# EAGLE design sensor_esp32 (EAGLE 6.2)
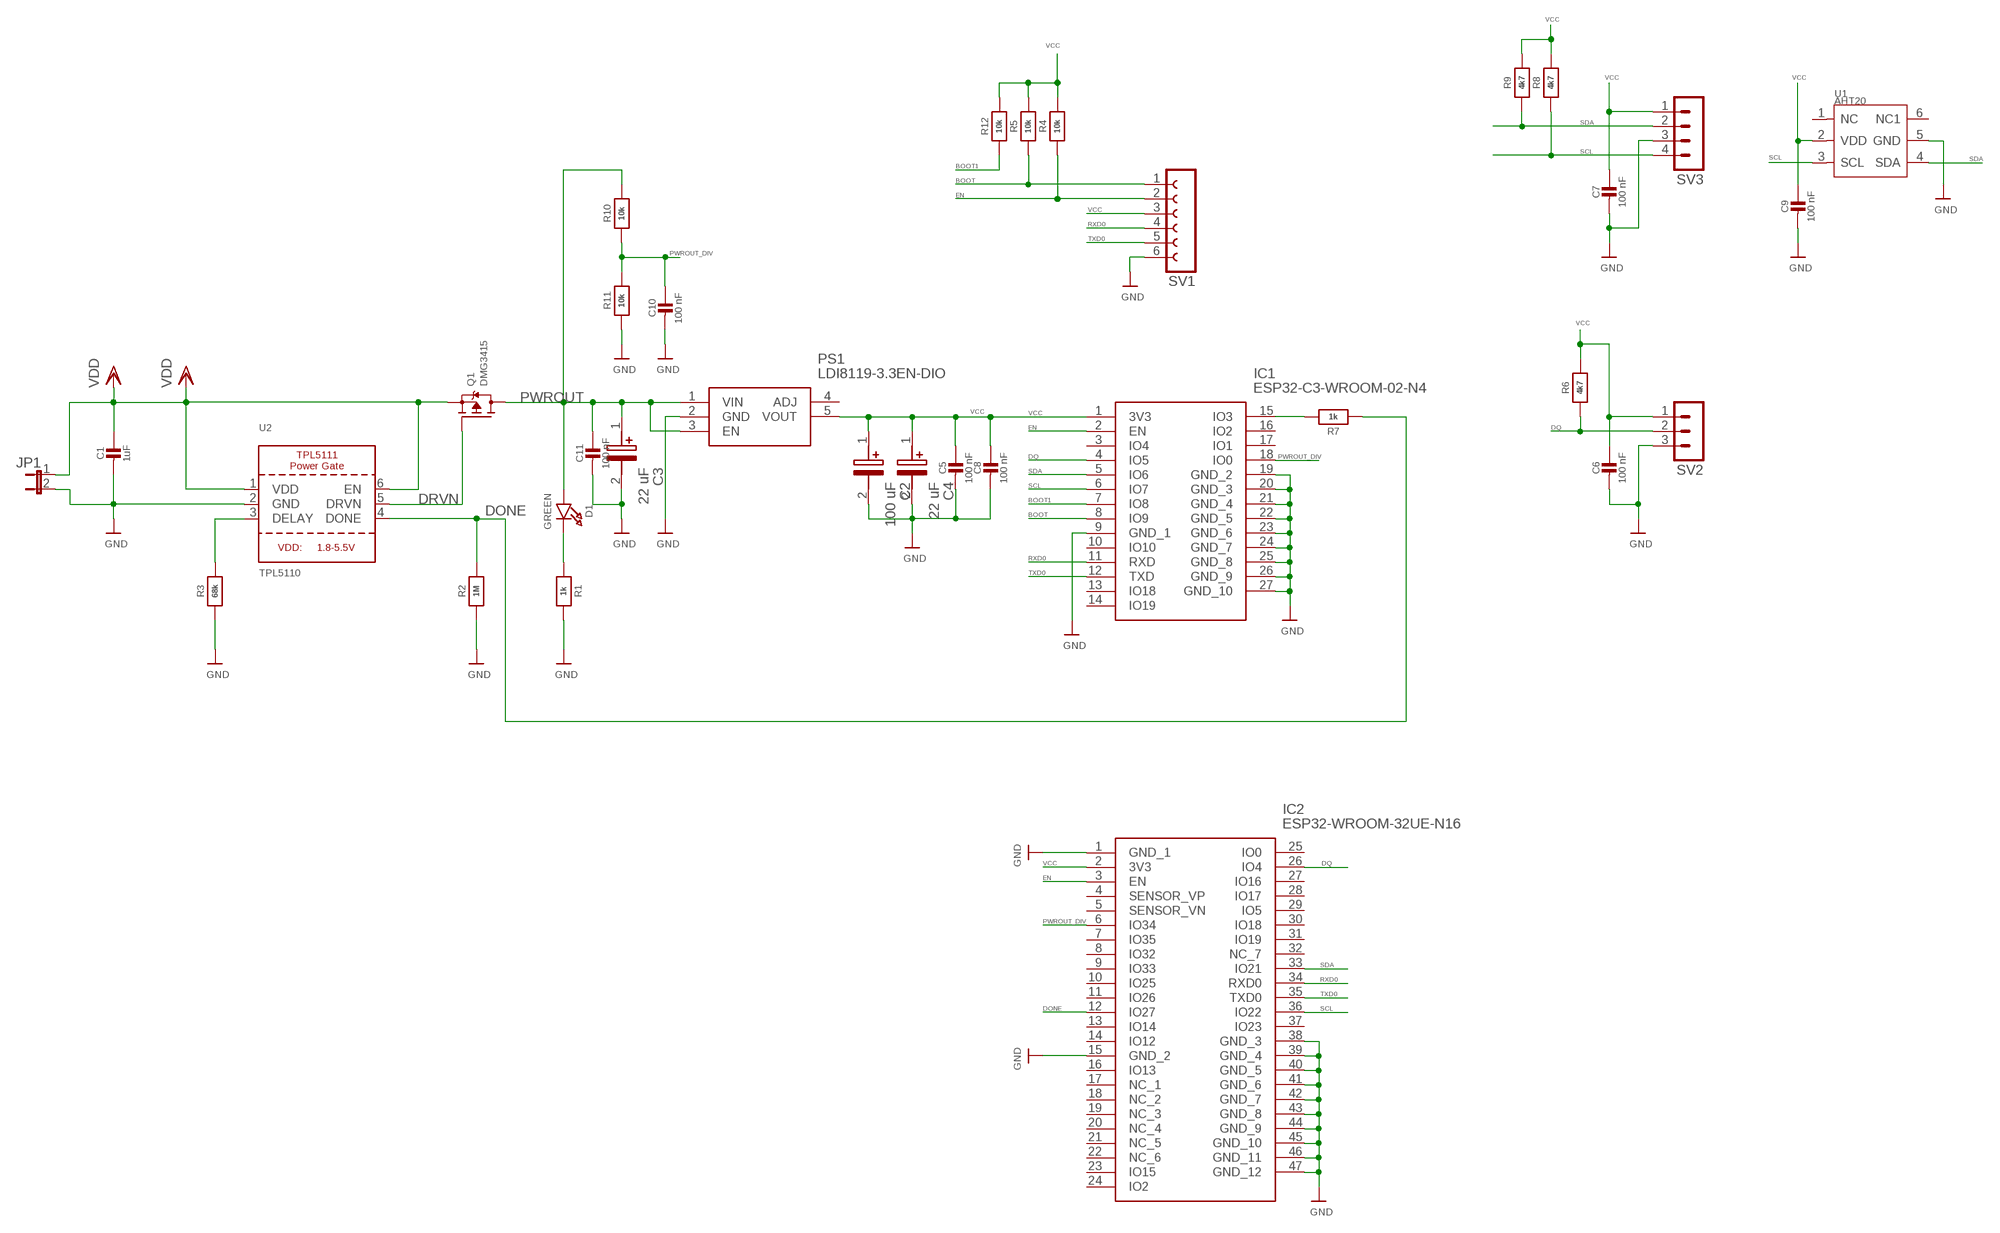
[diagram p0: schematic, sheet 1]

## Parts
C1  1uF  CAP_CERAMIC0805-NOOUTLINE  [0805-NO]
C2  100 uF  293D107X9010C2TE3  [CAPPM6032X280N]
C3  22 uF  293D226X9010A2TE3  [CAPPM3216X180N]
C4  22 uF  293D226X9010A2TE3  [CAPPM3216X180N]
C5  100 nF  CAP_CERAMIC_0603  [_0603]
C6  100 nF  CAP_CERAMIC_0603  [_0603]
C7  100 nF  CAP_CERAMIC_0603  [_0603]
C8  100 nF  CAP_CERAMIC_0603  [_0603]
C9  100 nF  CAP_CERAMIC_0603  [_0603]
C10  100 nF  CAP_CERAMIC_0603  [_0603]
C11  100 nF  CAP_CERAMIC_0603  [_0603]
D1  GREEN  LED0805_NOOUTLINE  [CHIPLED_0805_NOOUTLINE]
IC1  ESP32-C3-WROOM-02-N4  [ESP32C3WROOM02N4]
IC2  ESP32-WROOM-32UE-N16  [ESP32WROOM32UEN16]
JP1  JP1E  [JP1]
PS1  LDI8119-3.3EN-DIO  AP2202K-3.3TRG1  [SOT95P282X145-5N]
Q1  DMG3415  MOSFET-PWIDE  [SOT23-WIDE]
R1  1k  RESISTOR_0603  [_0603]
R2  1M  RESISTOR_0603  [_0603]
R3  68k  RESISTOR_0603  [_0603]
R4  10k  RESISTOR_0603  [_0603]
R5  10k  RESISTOR_0603  [_0603]
R6  4k7  RESISTOR_0603  [_0603]
R7  1k  RESISTOR_0603  [_0603]
R8  4k7  RESISTOR_0603  [_0603]
R9  4k7  RESISTOR_0603  [_0603]
R10  10k  RESISTOR_0603  [_0603]
R11  10k  RESISTOR_0603  [_0603]
R12  10k  RESISTOR_0603  [_0603]
SV1  FE06-1  [FE06]
SV2  MA03-1  [MA03-1]
SV3  MA04-1  [MA04-1]
U1  AHT20  SENSOR-AHT20  [SNR6-1.0-3X3X1MM]
U2  TPL5110  TPL5111  [SOT23-6]

## Nets
BOOT: IC1.8(IO9) R5.1 SV1.1
BOOT1: IC1.7(IO8) R12.1
DELAY: R3.2 U2.3(DELAY)
DONE: IC2.12(IO27) R2.2 R7.1 U2.4(DONE)
DQ: IC1.4(IO5) IC2.26(IO4) R6.1 SV2.2
DRVN: Q1.1(G) U2.5(DRVN)
EN: IC1.2(EN) IC2.3(EN) R4.1 SV1.2
GND: C1.2 C2.2(-) C3.2(-) C4.2(-) C5.2 C6.2 C7.2 C8.2 C9.2 C10.2 C11.2 IC1.9(GND_1) IC1.19(GND_2) IC1.20(GND_3) IC1.21(GND_4) IC1.22(GND_5) IC1.23(GND_6) IC1.24(GND_7) IC1.25(GND_8) IC1.26(GND_9) IC1.27(GND_10) IC2.1(GND_1) IC2.15(GND_2) IC2.38(GND_3) IC2.39(GND_4) IC2.40(GND_5) IC2.41(GND_6) IC2.42(GND_7) IC2.43(GND_8) IC2.44(GND_9) IC2.45(GND_10) IC2.46(GND_11) IC2.47(GND_12) JP1.2 PS1.2(GND) R1.2 R2.1 R3.1 R11.1 SV1.6 SV2.3 SV3.3 U1.5(GND) U2.2(GND)
N$1: IC1.15(IO3) R7.2
N$3: D1.C R1.1
PWROUT: C3.1(+) C11.1 D1.A PS1.1(VIN) PS1.3(EN) Q1.3(D) R10.2
PWROUT_DIV: C10.1 IC1.18(IO0) IC2.6(IO34) R10.1 R11.2
RXD0: IC1.11(RXD) IC2.34(RXD0) SV1.4
SCL: IC1.6(IO7) IC2.36(IO22) R8.1 SV3.4 U1.3(SCL)
SDA: IC1.5(IO6) IC2.33(IO21) R9.1 SV3.2 U1.4(SDA)
TXD0: IC1.12(TXD) IC2.35(TXD0) SV1.5
VCC: C2.1(+) C4.1(+) C5.1 C6.1 C7.1 C8.1 C9.1 IC1.1(3V3) IC2.2(3V3) PS1.5(VOUT) R4.2 R5.2 R6.2 R8.2 R9.2 R12.2 SV1.3 SV2.1 SV3.1 U1.2(VDD)
VDD: C1.1 JP1.1 Q1.2(S) U2.1(VDD) U2.6(EN)
Unconnected: IC1.3(IO4) IC1.10(IO10) IC1.13(IO18) IC1.14(IO19) IC1.16(IO2) IC1.17(IO1) IC2.4(SENSOR_VP) IC2.5(SENSOR_VN) IC2.7(IO35) IC2.8(IO32) IC2.9(IO33) IC2.10(IO25) IC2.11(IO26) IC2.13(IO14) IC2.14(IO12) IC2.16(IO13) IC2.17(NC_1) IC2.18(NC_2) IC2.19(NC_3) IC2.20(NC_4) IC2.21(NC_5) IC2.22(NC_6) IC2.23(IO15) IC2.24(IO2) IC2.25(IO0) IC2.27(IO16) IC2.28(IO17) IC2.29(IO5) IC2.30(IO18) IC2.31(IO19) IC2.32(NC_7) IC2.37(IO23) PS1.4(ADJ) U1.1(NC) U1.6(NC1)

## Library data of the parts
C1 C5-C11 = microbuilder:CAP_CERAMIC: Ceramic Capacitors For new designs, use the packages preceded by an '_' character since they are more reliable: The following footprints should be used on most boards: _0402 - Standard footprint for regular board layouts _0603 - Standard footprint for regular board layouts _0805 - Standard footprint for regular board layouts _1206 - Standard footprint for regular board layouts For extremely tight-pitch boards where space is at a premium, the following 'micro-pitch' footprints can be used (smaller pads, no silkscreen outline, etc.): _0402MP - Micro-pitch footprint for very dense/compact boards _0603MP - Micro-pitch footprint for very dense/compact boards _0805MP - Micro-pitch footprint for very dense/compact boards _1206MP - Micro-pitch footprint for very dense/compact boards
C2 = 293D107X9010C2TE3:293D107X9010C2TE3: Solid Tantalum Surface Mount Chip Capacitors TANTAMOUNT(TM), Molded Case, Standard Industrial Grade Source: Datasheet <http://www.vishay.com/docs/40002/293d.pdf>; DESCRIPTION: Solid Tantalum Surface Mount Chip Capacitors TANTAMOUNT(TM), Molded Case, Standard Industrial Grade; HEIGHT: 2.8mm; MANUFACTURER_NAME: Vishay; MANUFACTURER_PART_NUMBER: 293D107X9010C2TE3
C3 C4 = 293D226X9010A2TE3:293D226X9010A2TE3: Solid Tantalum Surface Mount Chip Capacitors TANTAMOUNT(TM), Molded Case, Standard Industrial Grade Source: Datasheet <http://www.vishay.com/docs/40002/293d.pdf>; DESCRIPTION: Solid Tantalum Surface Mount Chip Capacitors TANTAMOUNT(TM), Molded Case, Standard Industrial Grade; HEIGHT: 1.8mm; MANUFACTURER_NAME: Vishay; MANUFACTURER_PART_NUMBER: 293D226X9010A2TE3
D1 = microbuilder:LED: LED 0603 - 0603 Surface Mount Package 2mA: Green LED - Low Power (3.9mcd, 2ma, 1.7Vf) - Digikey: 475-2709-2-ND Orange LED - Low Power (9.8mcd, 2ma, 1.8Vf) - Digikey: 475-1194-2-ND Red LED - Low Power (5mcd, 2ma, 1.8Vf) - Digikey: 475-1195-2-ND Yellow LED - Low Power (7mcd, 2ma, 1.8Vf) - Digikey: 475-1196-2-ND 5mA: Blue LED - Low Power (17mcd, 5ma, 2.9Vf) - Digikey: LNJ937W8CRACT-ND 0805 - 0805 Surface Mount Package 2mA: Red LED (8.8mcd, 2mA, 1.8Vf, Clear) - Low Power [Digikey: 475-2510-1-ND] Green LED (5mcd, 2mA, 1.8Vf, Clear) - Low Power [Digikey: 475-2730-1-ND] Yellow LED (11.3mcd, 2mA, 1.8Vf, Clear) - Low Power [Digikey: 475-2555-1-ND] 20mA: Red LED (104mcd, 20mA, Diffused) - LS R976 [Digikey: 475-1278-6-ND] Red LED (12mcd, 20mA, 2.0Vf, Clear) - APT2012EC [Digikey: 754-1128-1-ND] Green LED (15mcd, 20mA, 2.2Vf, Clear) - APT2012GC [Digikey: 754-1131-1-ND] Orange LED (160mcd, 20mA, 2.1Vf, Clear) - APT2012SECK [Digikey: 754-1130-1-ND] 1206 - 1206 Surface Mount Package Green LED (26mcd, 20mA, Diffused) - LG N971 [Digikey: 475-1407-6-ND] Red LED (15mcd, 20mA, Diffused) - LH N974 [Digikey: 475-1416-6-ND] Cree - Cree High-Power Surface Mount LEDs XPEBWT-L1-0000-00D50 - White 111lm 350mA 2.9Vf 6200K 110° XTEAWT-00-0000-00000LEE3 - White 114lm 350mA 2.85Vf 5000K 115° Everlight - Everlight 45-21 Series Surface Mount LEDs 45-21/QK2C-B2832AC2CB2/2T - Warm White 2000mcd 20mA 3.25Vf 3050K 120° 45-21/LK2C-B38452C4CB2/2T - Nuetral White 2000mcd 20mA 3.25Vf 4150K 120° 45-21/LK2C-B50634C6CB2/2T - Cold White 2200mcd 20mA 3.25Vf 5650K 120° PLCC2 Reverse Mount LS T77K-J1L2-1-0-2-R18-Z - Red 11.25mcd 2mA 1.8Vf 630nm 120° LO T77K-L1M2-24-Z - Orange 19.6mcd 2mA 1.8Vf 606nm 120° LY T77K-K2M1-26-Z - Yellow 15.7mcd 2mA 1.8Vf 587nm 120°
IC1 = ESP32-C3-WROOM-02-N4:ESP32-C3-WROOM-02-N4: WiFi Modules (802.11) (Engineering Samples) SMD module, ESP32-C3, 4MB SPI flash, PCB antenna, -40 C +85 C Source: Datasheet <https://www.mouser.ch/datasheet/2/891/Espressif_ESP32_C3_WROOM_02-2006871.pdf>; DESCRIPTION: WiFi Modules (802.11) (Engineering Samples) SMD module, ESP32-C3, 4MB SPI flash, PCB antenna, -40 C +85 C; HEIGHT: 3.35mm; MANUFACTURER_NAME: Espressif Systems; MANUFACTURER_PART_NUMBER: ESP32-C3-WROOM-02-N4
IC2 = ESP32-WROOM-32UE-N16:ESP32-WROOM-32UE-N16: Module: IoT; Bluetooth Low Energy,WiFi; SMD; 18x19.2x3.2mm; U.FL Source: Datasheet <https://www.espressif.com/sites/default/files/documentation/esp32-wroom-32e_esp32-wroom-32ue_datasheet_en.pdf>; DESCRIPTION: Module: IoT; Bluetooth Low Energy,WiFi; SMD; 18x19.2x3.2mm; U.FL; HEIGHT: 3.35mm; MANUFACTURER_NAME: Espressif Systems; MANUFACTURER_PART_NUMBER: ESP32-WROOM-32UE-N16
JP1 = jumper:JP1E: JUMPER
PS1 = AP2202K-3.3TRG1:AP2202K-3.3TRG1: DiodesZetex AP2202K-3.3TRG1, LDO Voltage Regulator, 150mA, 3.3 V +/-2%, 2.5 to 13.2 Vin, 5-Pin SOT-23 Source: Datasheet <https://www.diodes.com//assets/Datasheets/AP2202.pdf>; DESCRIPTION: DiodesZetex AP2202K-3.3TRG1, LDO Voltage Regulator, 150mA, 3.3 V +/-2%, 2.5 to 13.2 Vin, 5-Pin SOT-23; HEIGHT: 1.45mm; MANUFACTURER_NAME: Diodes Incorporated; MANUFACTURER_PART_NUMBER: AP2202K-3.3TRG1
Q1 = microbuilder:MOSFET-P: P-Channel Mosfet LEGEND VDS: Voltage Drain-Source ID: Drain Current RDS(ON): Drain-Source On-State Resistance VGS(TH): Gate-Source Threshold Voltage CISS: Drain-Source Input Capacitance SOT-23 Name VDS ID RDS(ON) VGS(TH) CISS Order Number IRLML5103 30V 760mA 600 mOhm -- 75pF @ 25V Digikey: IRLML5103PBFCT-ND IRLML6401 12V 4.3A 50 mOhm 950mV @ 250µA 830pF @ 10V Digikey: IRLML6401PBFTR-ND NTR0202PL 20V 400mA 800 mOhm 2.3V @ 250uA 70pF @ 5V Digikey: NTR0202PLT1GOSTR-ND NTR4101PT1G 20V 1.8A 85 mOhm 1.2V @ 250uA 675pF @ 10V Digikey: NTR4101PT1GOSCT-ND DMP2004K 20V 600mA 900 mOhm 1V @ 250uA 175pF @ 16V Digikey: DMP2004KDICT-ND PMV65XP 20V 3.9A 76 mOhm 950mV @ 1mA 725pF @ 20V Digikey: 568-2358-2-ND TO-252 Name VDS ID RDS(ON) VGS(TH) CISS Order Number AOD417 30V 25A 34 mOhm 3V @ 250µA 920pF @ 15V Digikey: 785-1106-2-ND
R1-R12 = microbuilder:RESISTOR: Resistors For new designs, use the packages preceded by an '_' character since they are more reliable: The following footprints should be used on most boards: _0402 - Standard footprint for regular board layouts _0603 - Standard footprint for regular board layouts _0805 - Standard footprint for regular board layouts _1206 - Standard footprint for regular board layouts For extremely tight-pitch boards where space is at a premium, the following 'micro-pitch' footprints can be used (smaller pads, no silkscreen outline, etc.): _0402MP - Micro-pitch footprint for very dense/compact boards _0603MP - Micro-pitch footprint for very dense/compact boards _0805MP - Micro-pitch footprint for very dense/compact boards _1206MP - Micro-pitch footprint for very dense/compact boards
SV1 = con-lsta:FE06-1: FEMALE HEADER; OC_FARNELL: unknown; OC_NEWARK: unknown
SV2 = con-lstb:MA03-1: PIN HEADER; OC_FARNELL: unknown; OC_NEWARK: unknown
SV3 = con-lstb:MA04-1: PIN HEADER; OC_FARNELL: unknown; OC_NEWARK: unknown
U1 = Longan-IC:SENSOR-AHT20
U2 = microbuilder:TPL5111: TPL5111 Timer Based Power Gate Selectable Time Intervals: 100 ms to 7200 s Current Consumption at 2.5 V: 35 nA (typical) Supply Voltage Range: 1.8 V to 5.5 V

## Board
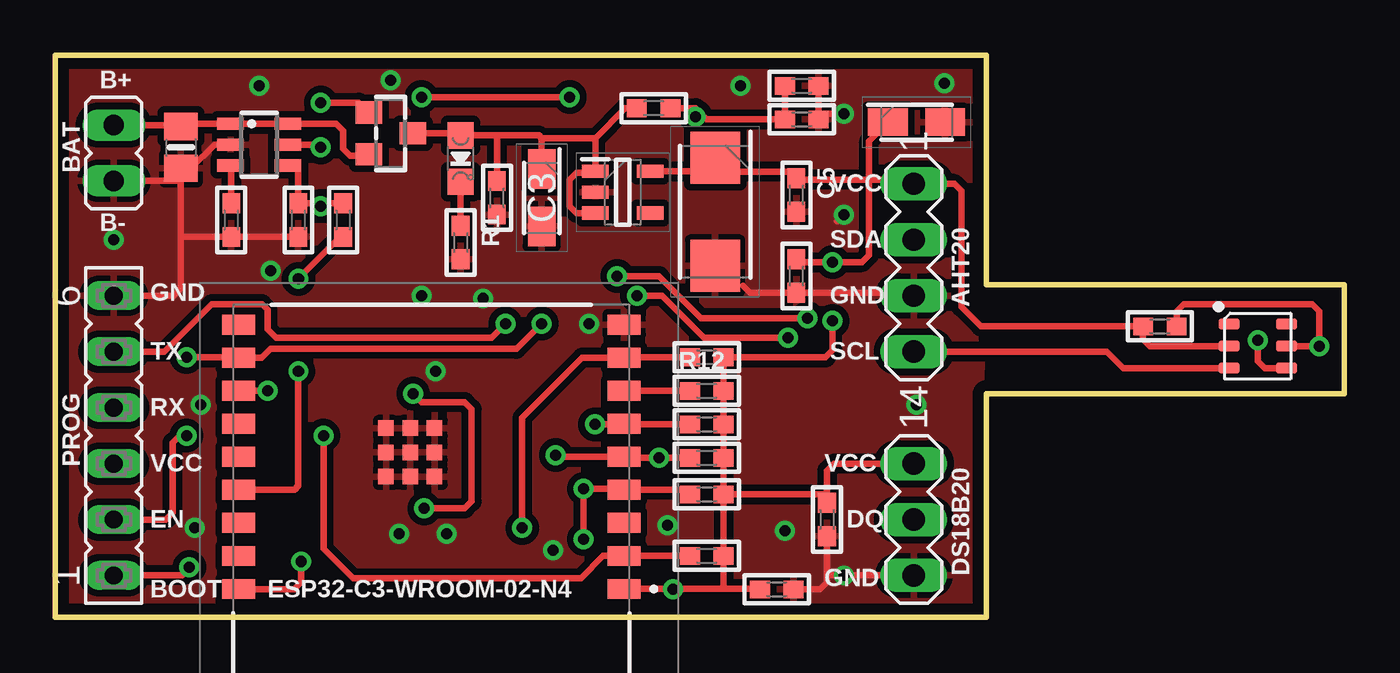
[diagram p1: board, top side]
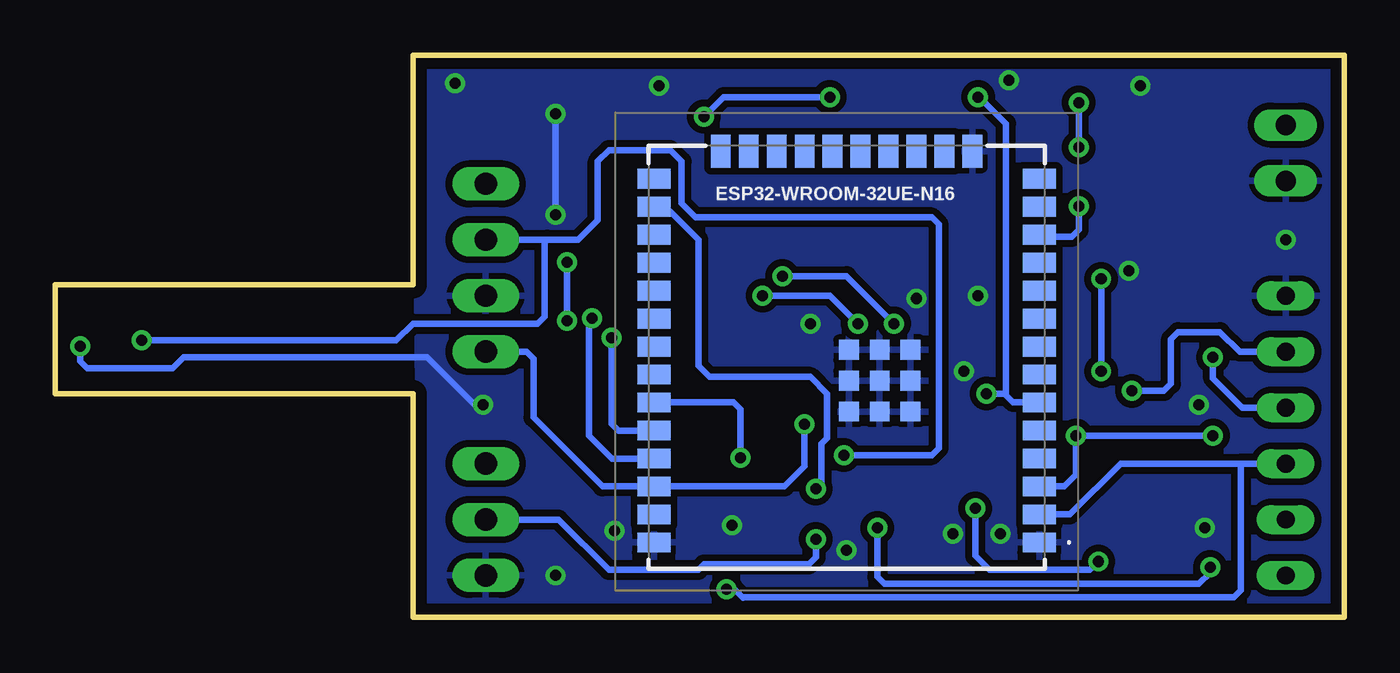
[diagram p2: board, bottom side, seen from below]

Size 58.55 x 25.53 mm. Coordinates in mm from the lower left corner, seen from the top.
Outline: 0,25.53 0,0 42.29,0 42.29,10.16 58.55,10.16 58.55,15.11 42.29,15.11 42.29,25.53 0,25.53
Copper layers (1*16): Top 0.035mm / dielectric 1.5mm / Bottom 0.035mm
Design rules: minimum track width 0.3mm, minimum drill 0.5mm, track to track 0.2mm, track to pad 0.2mm, pad to pad 0.2mm, via to via 0.2mm, smd to smd 0.1mm, copper to edge 0.5mm, drill to drill 8mil, minimum pad ring 10mil, minimum via ring 8mil, stop-mask expansion 2mil, vias tented up to drill 20mil, thermal gap 10mil

### Footprints (pad centres in the part's own frame; a part is rotated, then mirrored left to right if it is on the bottom)
0805-NO = smd 1.24 x 1.5: 1 -0.95,0; 2 0.95,0
CAPPM6032X280N = smd 2.35 x 2.25: 1 -2.45,0; 2 2.45,0
CAPPM3216X180N = smd 1.8 x 1.25: 1 -1.3,0; 2 1.3,0
_0603 = smd 0.9 x 0.8: 1 -0.762,0; 2 0.762,0
CHIPLED_0805_NOOUTLINE = smd 1.2 x 1.2: A 0,-1.05; C 0,1.05
ESP32C3WROOM02N4 = smd 1.5 x 0.9: 1 -9.71,6.2; 2 -9.71,4.7; 3 -9.71,3.2; 4 -9.71,1.7; 5 -9.71,0.2; 6 -9.71,-1.3; 7 -9.71,-2.8; 8 -9.71,-4.3; 9 -9.71,-5.8; 10 7.79,-5.8; 11 7.79,-4.3; 12 7.79,-2.8; 13 7.79,-1.3; 14 7.79,0.2; 15 7.79,1.7; 16 7.79,3.2; 17 7.79,4.7; 18 7.79,6.2 | smd 0.7 x 0.7: 19 0,0; 20 1.1,0; 21 1.1,1.1; 22 0,1.1; 23 -1.1,1.1; 24 -1.1,0; 25 -1.1,-1.1; 26 0,-1.1; 27 1.1,-1.1
ESP32WROOM32UEN16 = smd 1.5 x 0.9: 1 -8.75,8.66; 2 -8.75,7.39; 3 -8.75,6.12; 4 -8.75,4.85; 5 -8.75,3.58; 6 -8.75,2.31; 7 -8.75,1.04; 8 -8.75,-0.23; 9 -8.75,-1.5; 10 -8.75,-2.77; 11 -8.75,-4.04; 12 -8.75,-5.31; 13 -8.75,-6.58; 14 -8.75,-7.85; 25 8.75,-7.85; 26 8.75,-6.58; 27 8.75,-5.31; 28 8.75,-4.04; 29 8.75,-2.77; 30 8.75,-1.5; 31 8.75,-0.23; 32 8.75,1.04; 33 8.75,2.31; 34 8.75,3.58; 35 8.75,4.85; 36 8.75,6.12; 37 8.75,7.39; 38 8.75,8.66 | smd 0.9 x 1.5: 15 -5.715,-9.1; 16 -4.445,-9.1; 17 -3.175,-9.1; 18 -1.905,-9.1; 19 -0.635,-9.1; 20 0.635,-9.1; 21 1.905,-9.1; 22 3.175,-9.1; 23 4.445,-9.1; 24 5.715,-9.1 | smd 0.9 x 0.9: 39 -1.5,1.32; 40 -1.5,-0.08; 41 -0.1,-0.08; 42 -0.1,1.32; 43 -0.1,2.72; 44 -1.5,2.72; 45 -2.9,2.72; 46 -2.9,1.32; 47 -2.9,-0.08
JP1 = drill 0.914 long: 1 0,-1.27; 2 0,1.27
SOT95P282X145-5N = smd 1.2 x 0.6: 1 -1.25,0.95; 2 -1.25,0; 3 -1.25,-0.95; 4 1.25,-0.95; 5 1.25,0.95
SOT23-WIDE = smd 1 x 1.2: 1 -0.95,-1; 2 0.95,-1; 3 0,1
FE06 = drill 0.813 long: 1 -6.35,0; 2 -3.81,0; 3 -1.27,0; 4 1.27,0; 5 3.81,0; 6 6.35,0
MA03-1 = drill 1.016 long: 1 -2.54,0; 2 0,0; 3 2.54,0
MA04-1 = drill 1.016 long: 1 -3.81,0; 2 -1.27,0; 3 1.27,0; 4 3.81,0
SNR6-1.0-3X3X1MM = smd 0.95 x 0.5: 1 -1.3,1; 2 -1.3,0; 3 -1.3,-1; 4 1.3,-1; 5 1.3,0; 6 1.3,1
SOT23-6 = smd 0.55 x 1.2: 1 -0.95,-1.3; 2 0,-1.3; 3 0.95,-1.3; 4 0.95,1.3; 5 0,1.3; 6 -0.95,1.3

### Placement (x,y rotation side)
C1  5.71,21.34 270 top
C2  29.97,18.41 270 top
C3  22.1,19.05 270 top
C4  39.12,22.48 0 top
C5  33.66,19.18 270 top
C6  35.05,4.44 270 top
C7  33.66,15.49 270 top
C8  32.77,1.27 0 top
C9  50.16,13.21 0 top
C10  33.91,24.13 0 top
C11  20.07,19.05 270 top
D1  18.41,20.83 180 top
IC1  16.13,7.49 180 top
IC2  22.61,12.07 180 bottom
JP1  2.67,21.08 180 top
PS1  25.78,19.3 0 top
Q1  15.24,21.97 270 top
R1  18.41,17.02 270 top
R2  11.05,18.03 90 top
R3  8,18.03 90 top
R4  29.59,2.79 0 top
R5  29.59,11.81 0 top
R6  29.59,5.59 0 top
R7  13.08,18.03 270 top
R8  29.59,8.76 0 top
R9  29.59,7.24 0 top
R10  27.18,23.11 180 top
R11  33.91,22.61 180 top
R12  29.59,10.29 0 top
SV1  2.67,8.26 90 top
SV2  38.99,4.44 270 top
SV3  38.99,15.88 270 top
U1  54.61,12.32 0 top
U2  9.27,21.46 270 top

### Tracks (layer width: path | path; a pad name or v marks a point on that pad's centre or on a via)
BOOT  (via drill 0.5)
  Top 0.305: R5.1 25.84,11.81 IC1.8 23.94,11.79 21.21,9.06 v21.21,4.06 | v6.1,2.29 6.1,2.22 5.78,1.91 SV1.1
  Bottom 0.305: v21.21,4.06 21.21,1.84 20.89,1.52 6.6,1.52 6.1,2.03 v6.1,2.29
BOOT1
  Top 0.305: R12.1 IC1.7
DELAY
  Top 0.305: U2.3 8,20.48 R3.2
DONE  (via drill 0.5)
  Top 0.305: U2.4 11.05,20.51 R2.2 12.07,18.8 | 12.07,18.8 R7.1 | v12.07,18.67 12.07,18.8
  Bottom 0.305: IC2.12 13.75,17.27 12.38,17.27 12.07,17.59 v12.07,18.67
DQ  (via drill 0.5)
  Top 0.305: R6.1 28.83,5.79 IC1.4 25.84,5.84 v24,5.84 v24,3.56
  Bottom 0.305: SV2.2 35.69,4.44 33.4,2.16 29.34,2.16 29.08,2.41 24.32,2.41 24,2.73 v24,3.56 | v24,5.84 23.75,6.1 23.75,7.87 23.49,8.13 23.49,10.16 24.26,10.92 28.83,10.92 29.34,11.43 29.34,17.14 30.61,18.41 31.13,18.41 IC2.26
DRVN  (via drill 0.5)
  Top 0.305: U2.5 12.07,21.46 v12.07,21.34 | v12.07,23.37 13.79,23.37 Q1.1
  Bottom 0.305: v12.07,21.34 v12.07,23.37
EN  (via drill 0.5)
  Top 0.305: R4.1 IC1.2 24.89,2.79 23.88,1.78 13.52,1.78 12.19,3.11 v12.19,8.26 | SV1.2 5.02,4.44 5.33,4.76 5.33,7.94 5.65,8.26 v5.97,8.26
  Bottom 0.305: v5.97,8.26 v12.19,8.26 12.19,6.48 12.72,5.94 IC2.3
GND  (via drill 0.5)
  Top 0.305: U2.2 7.24,21.46 6.16,20.39 C1.2 5.71,19.81 | 5.71,17.27 R3.1 R2.1 | 5.71,17.27 5.71,19.81 | JP1.2 5.71,19.81 | SV1.6 5.4,14.61 5.71,14.92 5.71,17.27 | 31.24,15.05 31.56,14.73 C7.2 38.99,14.73 SV3.3 | 35.5,17.97 v35.81,18.29 | C8.2 34.73,1.27 35.05,1.59 35.05,1.91 | 35.05,1.91 C6.2 | SV2.3 35.05,1.91 | U1.5 v57.4,12.32 57.4,13.91 57.09,14.22 51.24,14.22 50.93,13.91 C9.2 | v35.81,22.86 34.93,22.86 R11.1 C10.2
  Bottom 0.305: v35.81,18.29 v35.81,22.86 | 57.4,12.19 v57.4,12.32 57.4,11.62 57.09,11.3 53.21,11.3 52.71,11.81 41.66,11.81 39.24,9.4 38.99,9.4
  other vias: 9.78,15.75 17.78,3.81 16.64,14.61 19.43,14.48 15.62,3.81 24.26,13.34 2.67,17.14 31.11,24.13 17.27,11.18 6.35,4.06 6.6,9.65 22.61,3.05 27.81,4.19 33.15,3.94 39.12,9.65 9.27,24.13 15.24,24.38 35.81,1.91 40.39,24.26
  pour Bottom (isolate 0.305): 0,25.53 42.29,25.53 41.91,0.13 0,0
  pour Top (isolate 0.305): 0,25.53 42.29,25.53 41.91,0 0,0
N$1  (via drill 0.5)
  Top 0.305: IC1.15 10.87,5.79 11.05,5.97 v11.05,11.18 | v11.05,15.37 12.95,17.27 R7.2
  Bottom 0.305: v11.05,11.18 v11.05,15.37
N$3
  Top 0.305: R1.1 D1.C
PWROUT
  Top 0.305: Q1.3 18.41,21.97 D1.A 20.07,21.88 | 24.53,21.75 PS1.1 24.53,20.19 23.68,20.19 23.37,19.88 23.37,18.67 23.68,18.35 PS1.3 | 24.53,21.75 22.1,21.75 | 26.69,23.11 R10.2 25.89,23.11 24.53,21.75 | 20.07,21.88 21.97,21.88 22.09,21.75 22.1,21.75 | C11.1 20.07,21.88 | C3.1 22.1,21.75
PWROUT_DIV  (via drill 0.5)
  Top 0.305: R10.1 29.08,23.11 | IC1.18 8.34,1.27 10.86,1.27 11.18,1.59 v11.18,2.54 | v29.08,22.73 29.08,23.11 | v16.64,23.62 v23.37,23.62 | v16.76,4.95 18.61,4.95 18.92,5.27 18.92,9.46 18.61,9.78 16.64,9.78 v16.26,10.16 | 29.08,23.11 29.59,22.61 R11.2 C10.1
  Bottom 0.305: 15.37,10.16 15.37,10.1 15.05,9.78 13.88,9.78 IC2.6 | 15.37,10.16 15.37,22.41 16.57,23.62 v16.64,23.62 | v11.18,2.54 11.56,2.16 16.13,2.16 16.76,2.79 v16.76,4.95 | v23.37,23.62 28.19,23.62 v29.08,22.73 | v16.26,10.16 15.37,10.16
RXD0  (via drill 0.5)
  Top 0.305: v5.97,11.81 8.34,11.81 IC1.11 9.38,11.79 9.78,12.19 20.95,12.19 v22.1,13.34 | v33.27,12.7 29.46,12.7 27.56,14.61 v26.42,14.61
  Bottom 0.305: SV1.4 4.64,9.53 5.97,10.86 v5.97,11.81 | IC2.34 32.96,8.49 33.27,8.8 v33.27,12.7 | v22.1,13.34 23.37,14.61 v26.42,14.61
SCL  (via drill 0.5)
  Top 0.305: 25.84,8.89 IC1.6 25.84,8.76 | v24.51,8.76 25.84,8.76 | U1.3 53.31,11.3 48.51,11.3 47.75,12.07 SV3.4 | R8.1 25.84,8.76
  Bottom 0.305: SV3.4 37.15,12.07 36.83,11.75 36.83,9.08 33.7,5.94 IC2.36 25.42,5.94 24.51,6.86 v24.51,8.76
SDA  (via drill 0.5)
  Top 0.305: R9.1 v27.43,7.24 25.84,7.24 IC1.5 22.73,7.29 v22.73,7.37 | U1.4 54.93,11.32 54.61,11.64 v54.61,12.57
  Bottom 0.305: 54.61,12.32 v54.61,12.57 43.05,12.57 42.29,13.34 36.64,13.34 36.32,13.65 36.32,17.02 36.2,17.14 | 39.88,17.14 SV3.2 36.2,17.14 | v22.73,7.37 18.73,7.37 18.41,7.68 18.41,17.84 18.73,18.16 29.46,18.16 30.1,18.8 30.1,20.7 30.61,21.21 33.4,21.21 33.91,20.7 33.91,18.03 34.8,17.14 36.2,17.14 | IC2.33 31.33,9.78 27.75,9.78 27.43,9.46 v27.43,7.24
TXD0  (via drill 0.5)
  Top 0.305: IC1.12 v9.65,10.29 | v34.16,13.59 29.34,13.59 27.43,15.49 v25.53,15.49 | SV1.5 4.95,12.07 7.11,14.22 9.4,14.22 9.65,13.97 9.65,13.08 10.03,12.7 19.81,12.7 v20.45,13.34
  Bottom 0.305: v9.65,10.29 8.19,10.29 7.87,10.6 7.87,12.64 7.56,12.95 5.65,12.95 4.76,12.07 SV1.5 | IC2.35 33.25,7.21 34.29,8.26 34.29,13.46 v34.16,13.59 | v25.53,15.49 22.61,15.49 v20.45,13.34
VCC  (via drill 0.5)
  Top 0.305: 36.96,19.87 38.99,19.87 SV3.1 40.83,19.68 41.15,19.37 41.15,14.1 42.04,13.21 C9.1 49.4,12.64 49.72,12.32 U1.2 | C7.1 33.66,16.13 v35.31,16.13 36.64,16.13 36.96,16.45 36.96,19.87 | R6.2 R9.2 R8.2 30.35,10.22 R12.2 R5.2 34.99,11.81 35.31,12.13 v35.31,13.46 | R6.2 R4.2 30.35,1.29 | 30.35,1.29 28.07,1.29 | 28.07,1.29 IC1.1 | 30.35,1.29 32,1.29 C8.1 | v28.07,1.27 28.07,1.29 | R6.2 35.05,5.59 C6.1 35.05,6.67 35.37,6.98 SV2.1 | PS1.5 29.36,20.25 C2.1 30.61,20.22 33.66,20.22 C5.1 33.72,19.87 36.96,19.87 | 36.96,19.87 36.96,21.62 C4.1
  Bottom 0.305: 4.38,6.98 SV1.3 4.7,6.98 | 4.7,6.98 4.7,1.23 5.02,0.91 27.28,0.91 27.3,0.89 27.71,1.29 28.07,1.29 v28.07,1.27 | v35.31,13.46 v35.31,16.13 | IC2.2 12.47,4.67 10.16,6.98 4.7,6.98
VDD
  Top 0.305: JP1.1 5.71,22.35 C1.1 5.71,22.41 U2.1 U2.6 12.76,22.41 13.08,22.09 13.08,21.27 13.4,20.95 14.24,20.95 Q1.2

### Text on the board
tNames: B+ | BAT | VCC | B- | SDA | GND | GND | AHT20 | TX | SCL | RX | PROG | VCC | VCC | EN | DQ | DS18B20 | BOOT | ESP32-C3-WROOM-02-N4 | GND
bNames: ESP32-WROOM-32UE-N16